# EAGLE design FZ-FILTER (EAGLE 7.7.0)

## Sheet 1 of 2
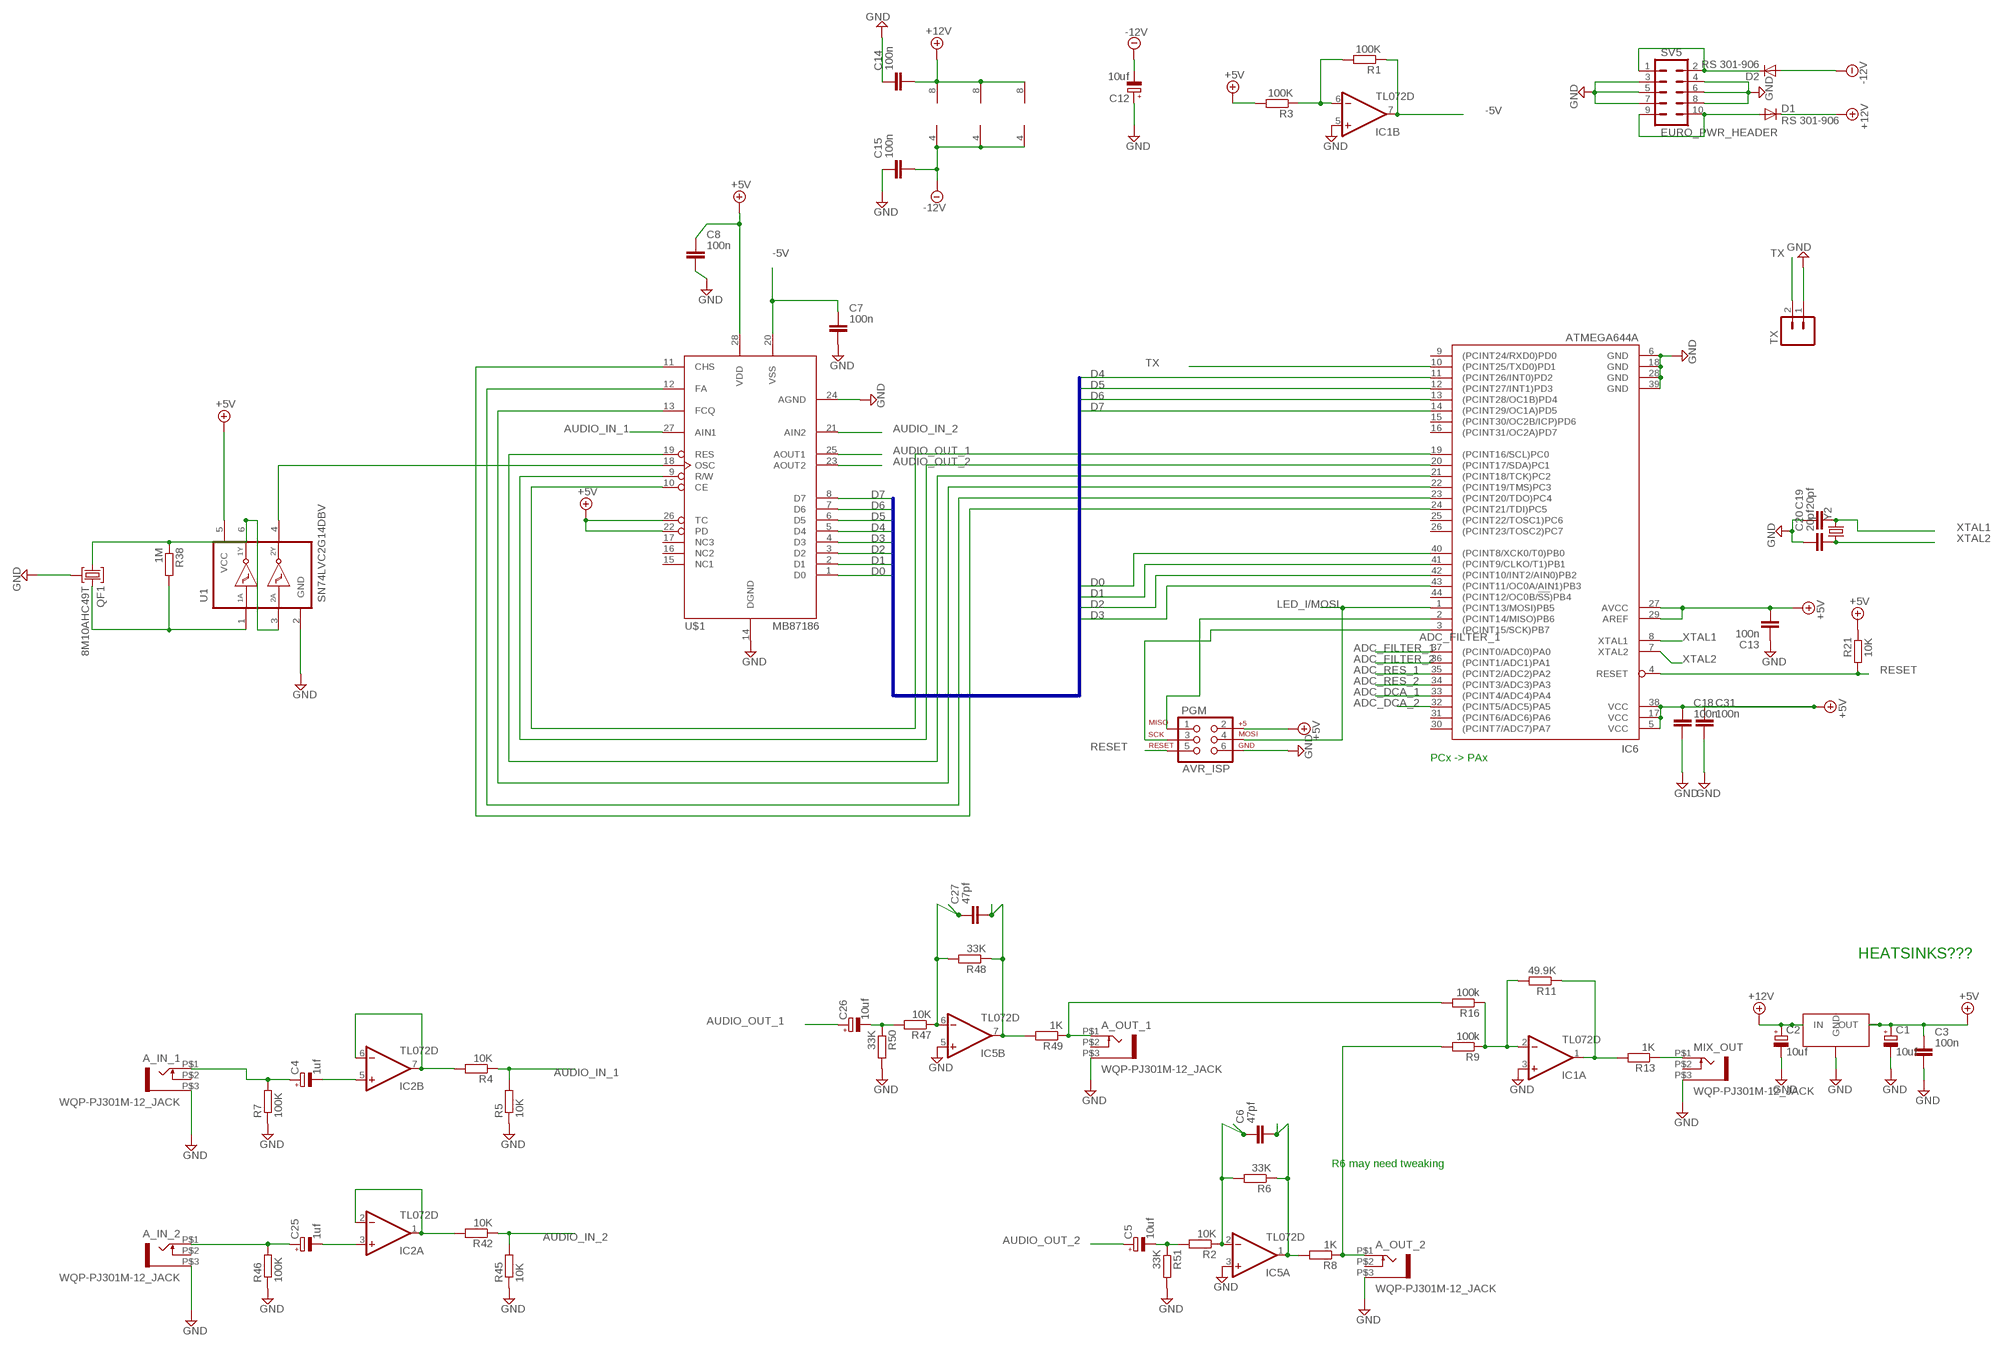
[diagram p0: schematic, sheet 1]

### Parts
A_IN_1  WQP-PJ301M-12_JACK  [WQP-PJ301M-12_JACK]
A_IN_2  WQP-PJ301M-12_JACK  [WQP-PJ301M-12_JACK]
A_OUT_1  WQP-PJ301M-12_JACK  [WQP-PJ301M-12_JACK]
A_OUT_2  WQP-PJ301M-12_JACK  [WQP-PJ301M-12_JACK]
C1  10uf  CPOL-EUB  [PANASONIC_B]
C2  10uf  CPOL-EUB  [PANASONIC_B]
C3  100n  CAPACITOR0603  [C0603]
C4  1uf  CPOL-EUB  [PANASONIC_B]
C5  10uf  CPOL-EUB  [PANASONIC_B]
C6  47pf  CAPACITOR0603  [C0603]
C7  100n  CAPACITOR0603  [C0603]
C8  100n  CAPACITOR0603  [C0603]
C12  10uf  CPOL-EUB  [PANASONIC_B]
C13  100n  CAPACITOR0603  [C0603]
C14  100n  CAPACITOR0603  [C0603]
C15  100n  CAPACITOR0603  [C0603]
C18  100n  CAPACITOR0603  [C0603]
C19  20pf  CAPACITOR0603  [C0603]
C20  20pf  CAPACITOR0603  [C0603]
C25  1uf  CPOL-EUB  [PANASONIC_B]
C26  10uf  CPOL-EUB  [PANASONIC_B]
C27  47pf  CAPACITOR0603  [C0603]
C31  100n  CAPACITOR0603  [C0603]
D1  RS 301-906  DIODESMB  [SMB-DIODE]
D2  RS 301-906  DIODESMB  [SMB-DIODE]
IC1  TL072D  [SO08]
IC2  TL072D  [SO08]
IC5  TL072D  [SO08]
IC6  ATMEGA644A  [TQFP44]
MIX_OUT  WQP-PJ301M-12_JACK  [WQP-PJ301M-12_JACK]
PGM  AVR_ISP  AVR_SPI_PRG_6PTH  [2X3]
QF1  8M10AHC49T  [HC49U]
R1  100K  RESISTOR0603  [R0603]
R2  10K  RESISTOR0603  [R0603]
R3  100K  RESISTOR0603  [R0603]
R4  10K  RESISTOR0603  [R0603]
R5  10K  RESISTOR0603  [R0603]
R6  33K  RESISTOR0603  [R0603]
R7  100K  RESISTOR0603  [R0603]
R8  1K  RESISTOR0603  [R0603]
R9  100k  RESISTOR0603  [R0603]
R11  49.9K  RESISTOR0603  [R0603]
R13  1K  RESISTOR0603  [R0603]
R16  100k  RESISTOR0603  [R0603]
R21  10K  RESISTOR0603  [R0603]
R38  1M  RESISTOR0603  [R0603]
R42  10K  RESISTOR0603  [R0603]
R45  10K  RESISTOR0603  [R0603]
R46  100K  RESISTOR0603  [R0603]
R47  10K  RESISTOR0603  [R0603]
R48  33K  RESISTOR0603  [R0603]
R49  1K  RESISTOR0603  [R0603]
R50  33K  RESISTOR0603  [R0603]
R51  33K  RESISTOR0603  [R0603]
SV5  EURO_PWR_HEADER  [EURO_PWR_HEADER]
TX  M02PTH  [1X02]
U1  SN74LVC2G14DBV  [SOT23-6]
U3  7805  VREG-7805-DPAK2  [VREG-7805-DPAK2]
U$1  MB87186  [DIP28]
Y2  CRYSTALSMD  [HC49UP]

### Nets
+5V: C1.+ C3.1 C8.1 C13.2 C18.1 C31.1 IC6.5(VCC) IC6.17(VCC) IC6.27(AVCC) IC6.29(AREF) IC6.38(VCC) PGM.2 R3.2 R21.2 U1.5(VCC) U3.VOUT(OUT) U$1.22(PD) U$1.26(TC) U$1.28(VDD) ; also sheet 2
+12V: C2.+ C14.2 D1.C IC1.8(P:V+) IC2.8(P:V+) IC5.8(P:V+) U3.VIN(IN) ; also sheet 2
-5V: C7.1 IC1.7(B:OUT) R1.1 U$1.20(VSS) ; also sheet 2
-12V: C12.- C15.2 D2.A IC1.4(P:V-) IC2.4(P:V-) IC5.4(P:V-) ; also sheet 2
ADC_DCA_1: IC6.33((PCINT4/ADC4)PA4) ; also sheet 2
ADC_DCA_2: IC6.32((PCINT5/ADC5)PA5) ; also sheet 2
ADC_FILTER_1: IC6.37((PCINT0/ADC0)PA0) ; also sheet 2
ADC_FILTER_2: IC6.36((PCINT1/ADC1)PA1) ; also sheet 2
ADC_MISO: IC6.2((PCINT14/MISO)PB6) PGM.1
ADC_RES_1: IC6.35((PCINT2/ADC2)PA2) ; also sheet 2
ADC_RES_2: IC6.34((PCINT3/ADC3)PA3) ; also sheet 2
ADC_SCK: IC6.3((PCINT15/SCK)PB7) PGM.3
AUDIO_IN_1: R4.1 R5.2 U$1.27(AIN1)
AUDIO_IN_2: R42.1 R45.2 U$1.21(AIN2)
AUDIO_OUT_1: C26.+ U$1.25(AOUT1)
AUDIO_OUT_2: C5.+ U$1.23(AOUT2)
D0: IC6.40((PCINT8/XCK0/T0)PB0) U$1.1(D0)
D1: IC6.41((PCINT9/CLKO/T1)PB1) U$1.2(D1)
D2: IC6.42((PCINT10/INT2/AIN0)PB2) U$1.3(D2)
D3: IC6.43((PCINT11/OC0A/AIN1)PB3) U$1.4(D3)
D4: IC6.11((PCINT26/INT0)PD2) U$1.5(D4)
D5: IC6.12((PCINT27/INT1)PD3) U$1.6(D5)
D6: IC6.13((PCINT28/OC1B)PD4) U$1.7(D6)
D7: IC6.14((PCINT29/OC1A)PD5) U$1.8(D7)
GND: A_IN_1.P$3 A_IN_2.P$3 A_OUT_1.P$3 A_OUT_2.P$3 C1.- C2.- C3.2 C7.2 C8.2 C12.+ C13.1 C14.1 C15.1 C18.2 C19.1 C20.1 C31.2 IC1.3(A:+IN) IC1.5(B:+IN) IC5.3(A:+IN) IC5.5(B:+IN) IC6.6(GND) IC6.18(GND) IC6.28(GND) IC6.39(GND) MIX_OUT.P$3 PGM.6 QF1.2 R5.1 R7.1 R45.1 R46.1 R50.2 R51.2 SV5.3 SV5.4 SV5.5 SV5.6 SV5.7 SV5.8 TX.1 U1.2(GND) U3.GND U$1.14(DGND) U$1.24(AGND) ; also sheet 2
LED_I/MOSI: IC6.1((PCINT13/MOSI)PB5) PGM.4
N$1: D2.C SV5.1 SV5.2
N$2: IC1.6(B:-IN) R1.2 R3.1
N$3: D1.A SV5.9 SV5.10
N$4: IC2.6(B:-IN) IC2.7(B:OUT) R4.2
N$6: C6.1 IC5.2(A:-IN) R2.1 R6.2
N$7: C6.2 IC5.1(A:OUT) R6.1 R8.2
N$8: C5.- R2.2 R51.1
N$9: A_OUT_1.P$1 R16.2 R49.1
N$13: IC1.2(A:-IN) R9.1 R11.2 R16.1
N$14: IC1.1(A:OUT) R11.1 R13.2
N$16: A_OUT_2.P$1 R8.1 R9.2
N$17: C4.- IC2.5(B:+IN)
N$18: A_IN_1.P$1 C4.+ R7.2
N$19: C25.- IC2.3(A:+IN)
N$28: IC2.1(A:OUT) IC2.2(A:-IN) R42.2
N$29: A_IN_2.P$1 C25.+ R46.2
N$30: C27.1 IC5.6(B:-IN) R47.1 R48.2
N$31: C27.2 IC5.7(B:OUT) R48.1 R49.2
N$32: C26.- R47.2 R50.1
N$34: MIX_OUT.P$1 R13.1
N$37: IC6.19((PCINT16/SCL)PC0) U$1.10(CE)
N$38: IC6.20((PCINT17/SDA)PC1) U$1.9(R/W)
N$39: IC6.21((PCINT18/TCK)PC2) U$1.19(RES)
N$42: IC6.22((PCINT19/TMS)PC3) U$1.13(FCQ)
N$47: IC6.23((PCINT20/TDO)PC4) U$1.12(FA)
N$54: IC6.24((PCINT21/TDI)PC5) U$1.11(CHS)
N$56: U1.4(2Y) U$1.18(OSC)
N$60: QF1.1 R38.1 U1.3(2A) U1.6(1Y)
N$62: QF1.3 R38.2 U1.1(1A)
RESET: IC6.4(RESET) PGM.5 R21.1
TX: IC6.10((PCINT25/TXD0)PD1) TX.2
XTAL1: C19.2 IC6.8(XTAL1) Y2.2
XTAL2: C20.2 IC6.7(XTAL2) Y2.1
Unconnected: A_IN_1.P$2 A_IN_2.P$2 A_OUT_1.P$2 A_OUT_2.P$2 IC6.9((PCINT24/RXD0)PD0) IC6.15((PCINT30/OC2B/ICP)PD6) IC6.16((PCINT31/OC2A)PD7) IC6.25((PCINT22/TOSC1)PC6) IC6.26((PCINT23/TOSC2)PC7) IC6.30((PCINT7/ADC7)PA7) IC6.31((PCINT6/ADC6)PA6) IC6.44((PCINT12/OC0B/!SS!)PB4) MIX_OUT.P$2 U$1.15(NC1) U$1.16(NC2) U$1.17(NC3)

### Buses
D[0..7]

### Notes on the sheet
- PCx -> PAx
- HEATSINKS???
- R6 may need tweaking

## Sheet 2 of 2
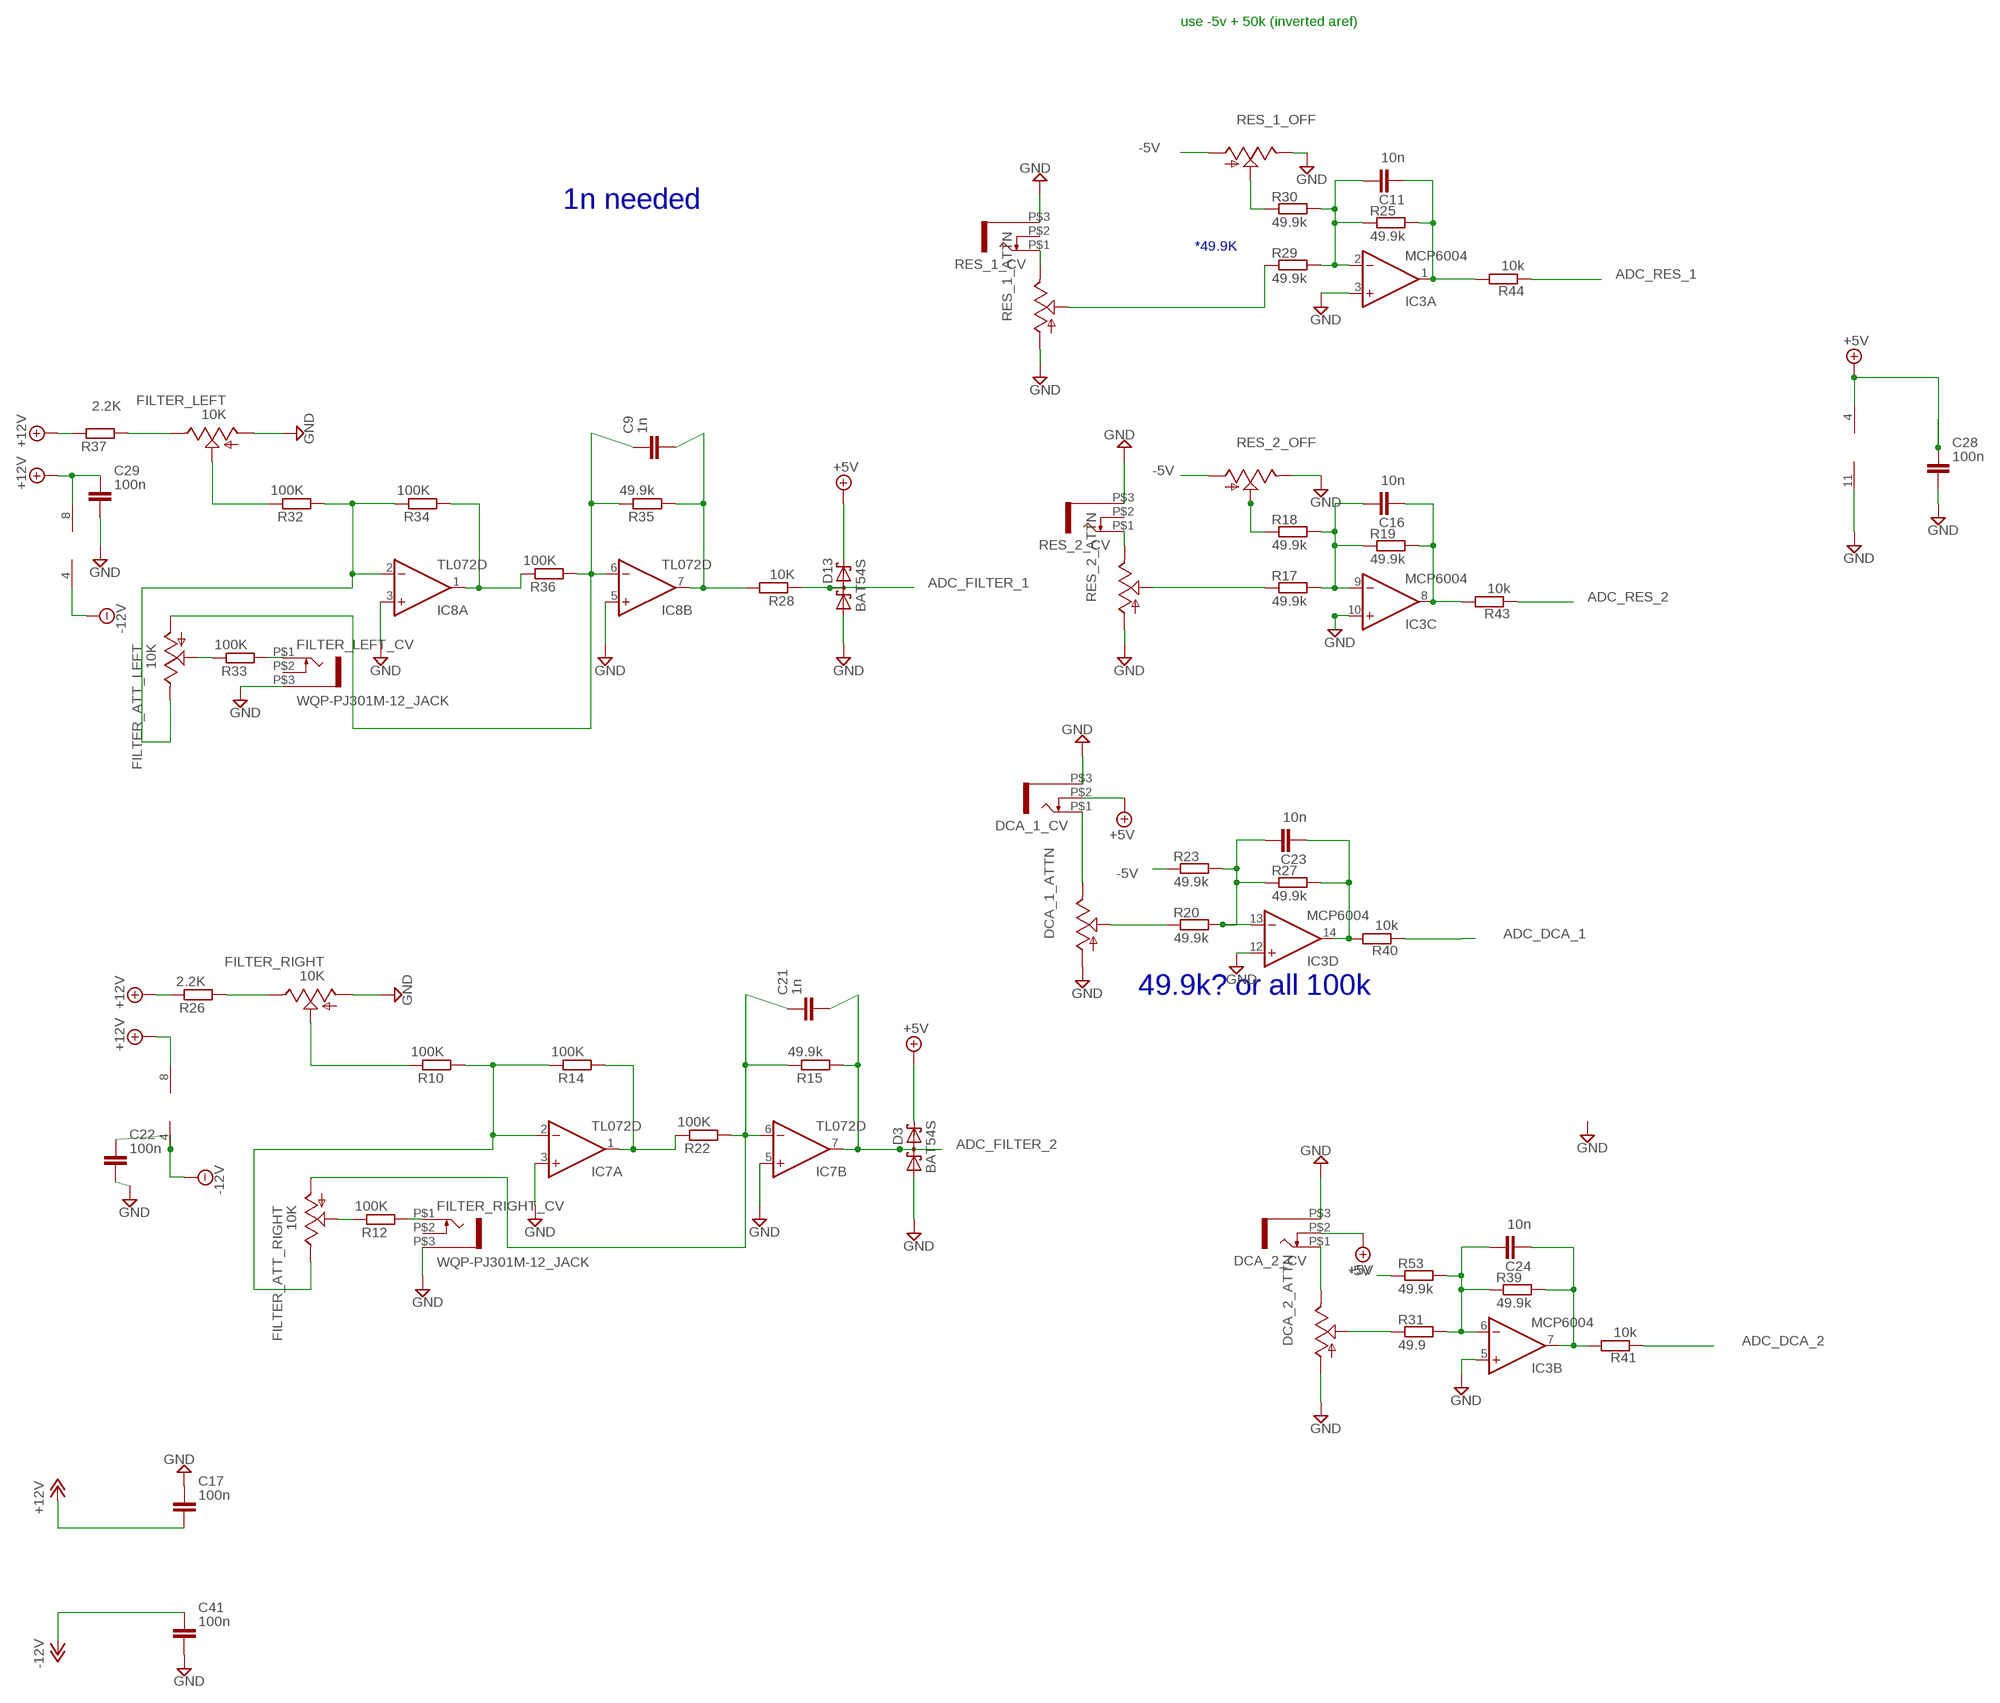
[diagram p1: schematic, sheet 2]

### Parts
C9  1n  CAPACITOR0603  [C0603]
C11  10n  CAPACITOR0603  [C0603]
C16  10n  CAPACITOR0603  [C0603]
C17  100n  CAPACITOR0603  [C0603]
C21  1n  CAPACITOR0603  [C0603]
C22  100n  CAPACITOR0603  [C0603]
C23  10n  CAPACITOR0603  [C0603]
C24  10n  CAPACITOR0603  [C0603]
C28  100n  CAPACITOR0603  [C0603]
C29  100n  CAPACITOR0603  [C0603]
C41  100n  CAPACITOR0603  [C0603]
D3  BAT54S  [SOT23]
D13  BAT54S  [SOT23]
DCA_1_ATTN  ALPHA-9MMA  [EVUF]
DCA_1_CV  WQP-PJ301M-12_JACK  [WQP-PJ301M-12_JACK]
DCA_2_ATTN  ALPHA-9MMA  [EVUF]
DCA_2_CV  WQP-PJ301M-12_JACK  [WQP-PJ301M-12_JACK]
FILTER_ATT_LEFT  10K  ALPHA-9MMA  [EVUF]
FILTER_ATT_RIGHT  10K  ALPHA-9MMA  [EVUF]
FILTER_LEFT  10K  ALPHA-9MMA  [EVUF]
FILTER_LEFT_CV  WQP-PJ301M-12_JACK  [WQP-PJ301M-12_JACK]
FILTER_RIGHT  10K  ALPHA-9MMA  [EVUF]
FILTER_RIGHT_CV  WQP-PJ301M-12_JACK  [WQP-PJ301M-12_JACK]
IC3  MCP6004  TL074D  [SO14]
IC7  TL072D  [SO08]
IC8  TL072D  [SO08]
R10  100K  RESISTOR0603  [R0603]
R12  100K  RESISTOR0603  [R0603]
R14  100K  RESISTOR0603  [R0603]
R15  49.9k  RESISTOR0603  [R0603]
R17  49.9k  RESISTOR0603  [R0603]
R18  49.9k  RESISTOR0603  [R0603]
R19  49.9k  RESISTOR0603  [R0603]
R20  49.9k  RESISTOR0603  [R0603]
R22  100K  RESISTOR0603  [R0603]
R23  49.9k  RESISTOR0603  [R0603]
R25  49.9k  RESISTOR0603  [R0603]
R26  2.2K  RESISTOR0603  [R0603]
R27  49.9k  RESISTOR0603  [R0603]
R28  10K  RESISTOR0603  [R0603]
R29  49.9k  RESISTOR0603  [R0603]
R30  49.9k  RESISTOR0603  [R0603]
R31  49.9  RESISTOR0603  [R0603]
R32  100K  RESISTOR0603  [R0603]
R33  100K  RESISTOR0603  [R0603]
R34  100K  RESISTOR0603  [R0603]
R35  49.9k  RESISTOR0603  [R0603]
R36  100K  RESISTOR0603  [R0603]
R37  2.2K  RESISTOR0603  [R0603]
R39  49.9k  RESISTOR0603  [R0603]
R40  10k  RESISTOR0603  [R0603]
R41  10k  RESISTOR0603  [R0603]
R43  10k  RESISTOR0603  [R0603]
R44  10k  RESISTOR0603  [R0603]
R53  49.9k  RESISTOR0603  [R0603]
RES_1_ATTN  ALPHA-9MMA  [EVUF]
RES_1_CV  WQP-PJ301M-12_JACK  [WQP-PJ301M-12_JACK]
RES_1_OFF  ALPHA-9MMA  [EVUF]
RES_2_ATTN  ALPHA-9MMA  [EVUF]
RES_2_CV  WQP-PJ301M-12_JACK  [WQP-PJ301M-12_JACK]
RES_2_OFF  ALPHA-9MMA  [EVUF]

### Nets
+5V: C28.1 D3.2(C2) D13.2(C2) DCA_1_CV.P$2 DCA_2_CV.P$2 IC3.4(P:V+) ; also sheet 1
+12V: C17.2 C29.1 IC7.8(P:V+) IC8.8(P:V+) R26.2 R37.2 ; also sheet 1
-5V: R23.1 R53.1 RES_1_OFF.1(A) RES_2_OFF.1(A) ; also sheet 1
-12V: C22.1 C41.1 IC7.4(P:V-) IC8.4(P:V-) ; also sheet 1
ADC_DCA_1: R40.1 ; also sheet 1
ADC_DCA_2: R41.1 ; also sheet 1
ADC_FILTER_1: D13.3(C1A2) R28.1 ; also sheet 1
ADC_FILTER_2: C21.2 D3.3(C1A2) IC7.7(B:OUT) R15.1 ; also sheet 1
ADC_RES_1: R44.1 ; also sheet 1
ADC_RES_2: R43.1 ; also sheet 1
GND: C17.1 C22.2 C28.2 C29.2 C41.2 D3.1(A1) D13.1(A1) DCA_1_ATTN.1(A) DCA_1_CV.P$3 DCA_2_ATTN.1(A) DCA_2_CV.P$3 FILTER_LEFT.1(A) FILTER_LEFT_CV.P$3 FILTER_RIGHT.1(A) FILTER_RIGHT_CV.P$3 IC3.3(A:+IN) IC3.5(B:+IN) IC3.10(C:+IN) IC3.11(P:V-) IC3.12(D:+IN) IC7.3(A:+IN) IC7.5(B:+IN) IC8.3(A:+IN) IC8.5(B:+IN) RES_1_ATTN.1(A) RES_1_CV.P$3 RES_1_OFF.3(E) RES_2_ATTN.1(A) RES_2_CV.P$3 RES_2_OFF.3(E) ; also sheet 1
I7: C9.2 IC8.7(B:OUT) R28.2 R35.1
N$5: RES_1_ATTN.3(E) RES_1_CV.P$1
N$10: R30.1 RES_1_OFF.2(S)
N$11: C24.1 IC3.6(B:-IN) R31.2 R39.1 R53.2
N$12: C11.2 IC3.1(A:OUT) R25.2 R44.2
N$15: R29.1 RES_1_ATTN.2(S)
N$20: DCA_1_ATTN.3(E) DCA_1_CV.P$1
N$21: C16.1 IC3.9(C:-IN) R17.2 R18.2 R19.1
N$22: R18.1 RES_2_OFF.2(S)
N$23: RES_2_ATTN.3(E) RES_2_CV.P$1
N$24: C23.1 IC3.13(D:-IN) R20.2 R23.2 R27.1
N$25: DCA_1_ATTN.2(S) R20.1
N$26: DCA_2_ATTN.2(S) R31.1
N$27: C16.2 IC3.8(C:OUT) R19.2 R43.2
N$33: DCA_2_ATTN.3(E) DCA_2_CV.P$1
N$35: FILTER_RIGHT.2(S) R10.2
N$36: FILTER_ATT_RIGHT.3(E) IC7.2(A:-IN) R10.1 R14.2
N$40: C11.1 IC3.2(A:-IN) R25.1 R29.2 R30.2
N$41: FILTER_RIGHT_CV.P$1 R12.1
N$43: FILTER_ATT_RIGHT.2(S) R12.2
N$44: IC7.1(A:OUT) R14.1 R22.2
N$45: C21.1 FILTER_ATT_RIGHT.1(A) IC7.6(B:-IN) R15.2 R22.1
N$46: FILTER_RIGHT.3(E) R26.1
N$48: FILTER_LEFT.2(S) R32.2
N$49: FILTER_ATT_LEFT.3(E) IC8.2(A:-IN) R32.1 R34.2
N$50: FILTER_LEFT_CV.P$1 R33.1
N$51: IC8.1(A:OUT) R34.1 R36.2
N$52: C9.1 FILTER_ATT_LEFT.1(A) IC8.6(B:-IN) R35.2 R36.1
N$53: FILTER_LEFT.3(E) R37.1
N$55: FILTER_ATT_LEFT.2(S) R33.2
N$58: R17.1 RES_2_ATTN.2(S)
REL1_ADC: C23.2 IC3.14(D:OUT) R27.2 R40.2
REL2_ADC: C24.2 IC3.7(B:OUT) R39.2 R41.2
Unconnected: FILTER_LEFT_CV.P$2 FILTER_RIGHT_CV.P$2 RES_1_CV.P$2 RES_2_CV.P$2

### Notes on the sheet
- use -5v + 50k (inverted aref)
- 1n needed
- *49.9K
- 49.9k? or all 100k

## Library data of the parts
A_IN_1 A_IN_2 A_OUT_1 A_OUT_2 DCA_1_CV DCA_2_CV FILTER_LEFT_CV FILTER_RIGHT_CV MIX_OUT RES_1_CV RES_2_CV = allum_extras:WQP-PJ301M-12_JACK
C1 C2 C4 C5 C12 C25 C26 = rcl:CPOL-EU: POLARIZED CAPACITOR, European symbol
C3 C6-C9 C13-C15 C17-C22 C27-C29 C31 C41 = allum_extras:CAPACITOR
C11 C16 C23 C24 = local:CAPACITOR
D1 D2 = SparkFun:DIODE: Diode These are standard reverse protection diodes and small signal diodes. SMA package can handle up to about 1A. SOD-323 can handle about 200mA. What the SOD-323 package when ordering, there are some mfgs out there that are 5-pin packages.
D3 D13 = diode:BAT54S: Schottky Diodes Pin connection corrected 2011-05-04 Source: Fairchild .. BAT54.pdf
DCA_1_ATTN DCA_2_ATTN FILTER_ATT_LEFT FILTER_ATT_RIGHT FILTER_LEFT FILTER_RIGHT RES_1_ATTN RES_1_OFF RES_2_ATTN RES_2_OFF = TomW:ALPHA-9MM: 9 mm Square Rotary Potentiometers Source: Panasonic
IC1 IC2 IC5 IC7 IC8 = TomW:TL072: OP AMP
IC3 = gm-ics:TL074: OP AMP
IC6 = atmel:ATMEGA644: 8-bit Microcontroller with 64K Bytes In-System Programmable Flash Source: http://www.atmel.com/dyn/resources/prod_documents/doc2593.pdf; MPN: ATMEGA644PV-10AU; OC_FARNELL: 1455123; OC_NEWARK: 58M3748
PGM = SparkFun:AVR_SPI_PRG_6: AVR ISP 6 Pin This is the reduced ISP connector for AVR programming. Common on Arduino. This footprint will take up less PCB space and can be used with a 10-pin to 6-pin adapter such as SKU: BOB-08508
QF1 = crystal:8M10AHC49T: Monolithic Crystal Filters Source: www.vanlong.com; OC_FARNELL: unknown; OC_NEWARK: unknown
R1-R23 R25-R51 R53 = allum_extras:RESISTOR
SV5 = local:EURO_PWR_HEADER: Header 5x2 Standard 10-pin dual row 0.1" header. Commonly used with AVR-ISP. Use with Spark Fun Electronics SKU: PRT-00778
TX = SparkFun:M02: Header 2 Standard 2-pin 0.1" header. Use with straight break away headers (SKU : PRT-00116), right angle break away headers (PRT-00553), swiss pins (PRT-00743), machine pins (PRT-00117), and female headers (PRT-00115). Molex polarized connector foot print use with SKU : PRT-08233 with associated crimp pins and housings.
U1 = 74LV:SN74LVC2G14: DUAL SCHMITT-TRIGGER INVERTER
U3 = vreg-7805-dpak2:VREG-7805-DPAK2
U$1 = allum_extras:MB87186
Y2 = SparkFun:CRYSTAL: Crystals Various standard crystals. Proven footprints. Spark Fun Electronics SKU : COM-00534

## Board
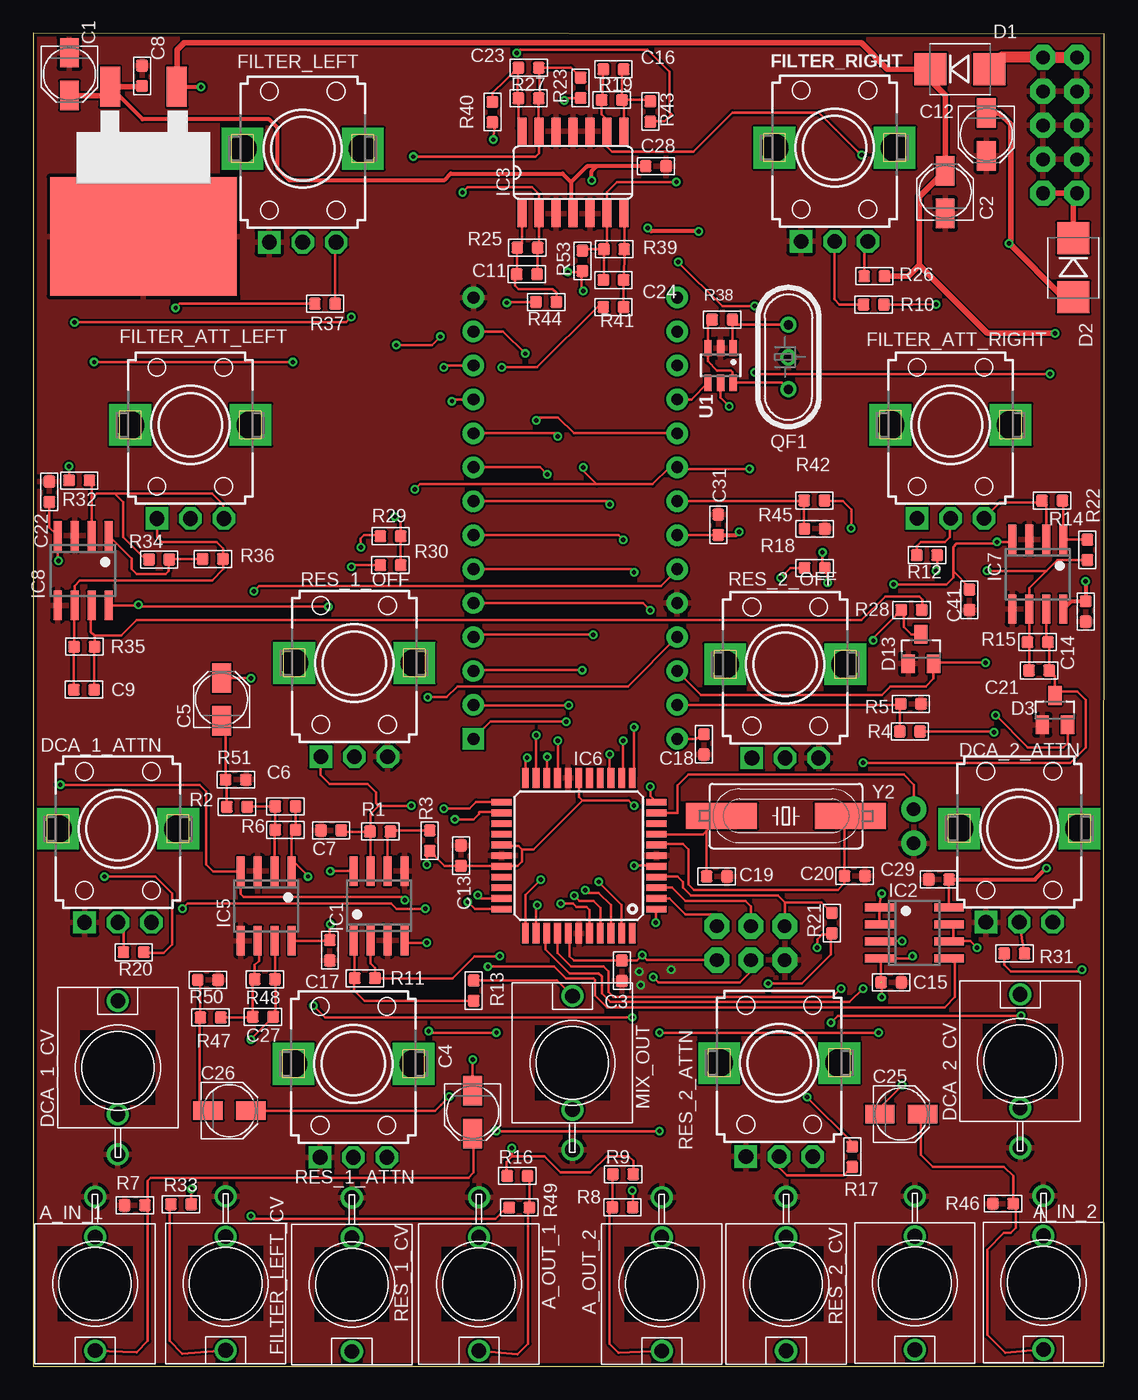
[diagram p2: board, top side]
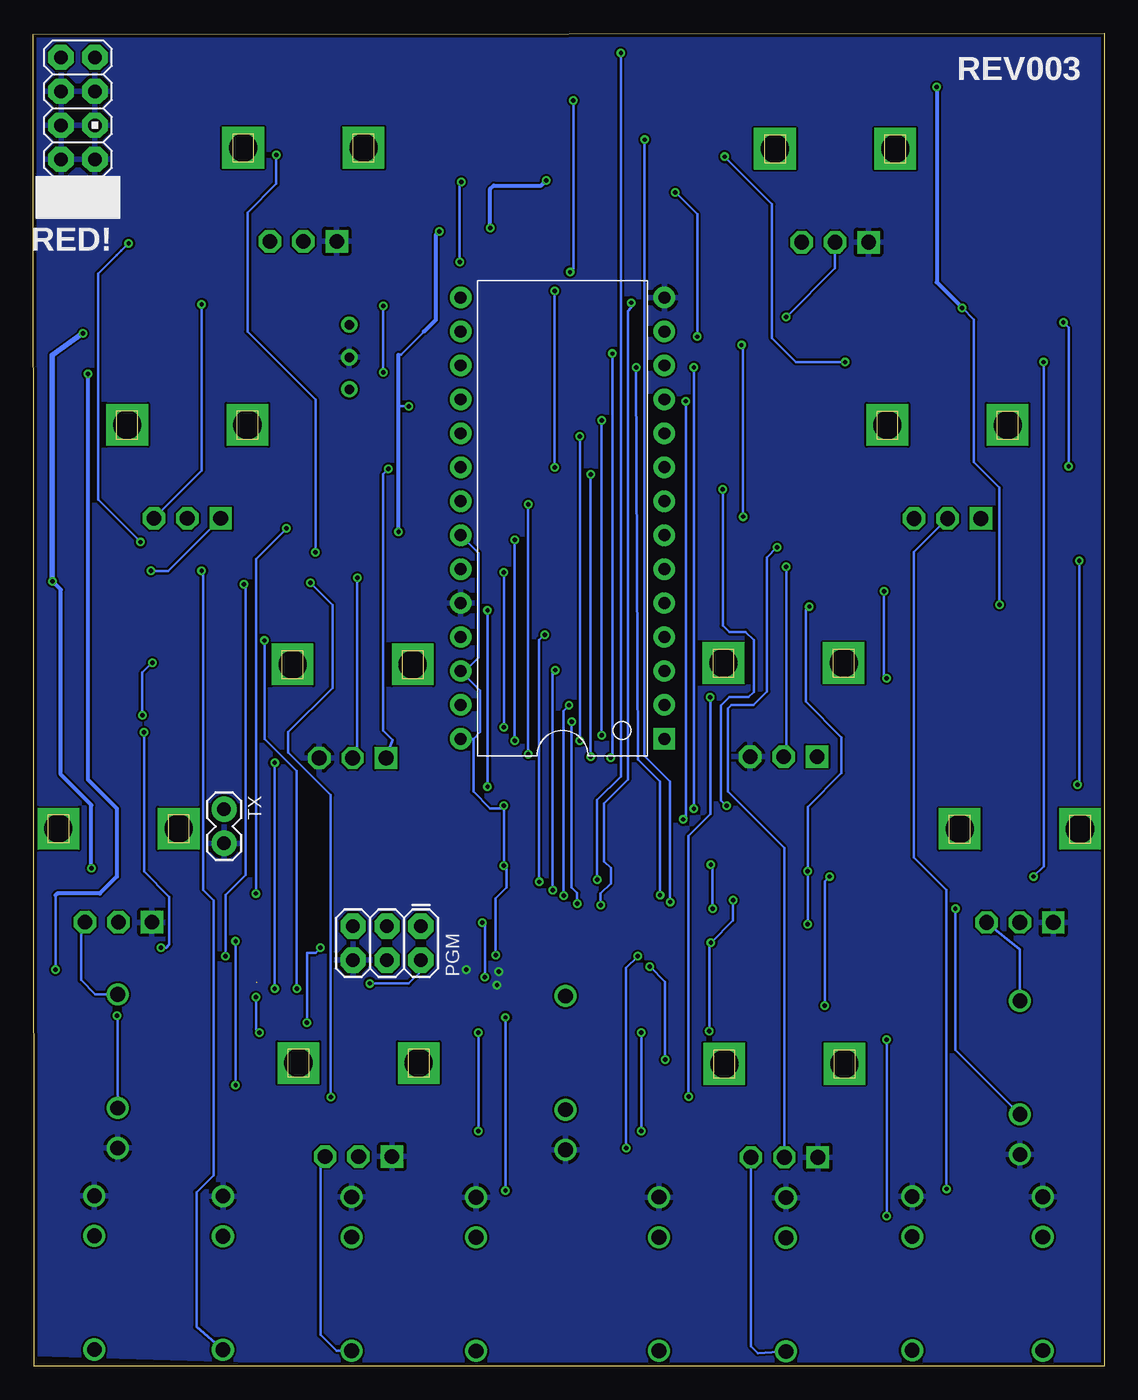
[diagram p3: board, bottom side, seen from below]

Size 80.13 x 99.7 mm. Coordinates in mm from the lower left corner, seen from the top.
Outline: 0,0 80.08,0 80.13,99.64 0,99.69 0,0
Copper layers (1*16): Top 0.035mm / dielectric 1.5mm / Bottom 0.035mm
Design rules "Fusion_eagle_rule_v1.1": minimum track width 6mil, minimum drill 12mil, track to track 6mil, track to pad 6mil, pad to pad 6mil, via to via 6mil, smd to smd 0mil, copper to edge 10mil, drill to drill 10mil, minimum pad ring 10mil, minimum via ring 6mil, stop-mask expansion 2mil, vias tented up to drill 100mil, thermal gap 10mil

### Footprints (pad centres in the part's own frame; a part is rotated, then mirrored left to right if it is on the bottom)
WQP-PJ301M-12_JACK = drill 1.1: P$1 0,5; P$2 0,-3.5; P$3 0,-6.5
PANASONIC_B = smd 2.2 x 1.4: + 1.6,0; - -1.6,0
C0603 = smd 0.889 x 0.889: 1 -0.762,0; 2 0.762,0
SMB-DIODE = smd 2.4 x 2.4: A 2.2,0; C -2.2,0
SOT23 = smd 1 x 1.4: 1 -0.95,-1.1; 2 0.95,-1.1; 3 0,1.1
EVUF = drill 1.1 pad 1.676 square: 1 -2.5,-7 | drill 1.1 pad 1.676 octagon: 2 0,-7; 3 2.5,-7 | drill 2.1 pad 2.8 square: M1 4.5,0; M2 -4.5,0
SO08 = smd 0.6 x 2.2: 1 -1.905,-2.6; 2 -0.635,-2.6; 3 0.635,-2.6; 4 1.905,-2.6; 5 1.905,2.6; 6 0.635,2.6; 7 -0.635,2.6; 8 -1.905,2.6
SO14 = smd 0.66 x 2.032: 1 -3.81,-3.073; 2 -2.54,-3.073; 3 -1.27,-3.073; 4 0,-3.073; 5 1.27,-3.073; 6 2.54,-3.073; 7 3.81,-3.073; 8 3.81,3.073; 9 2.54,3.073; 10 1.27,3.073; 11 0,3.073; 12 -1.27,3.073; 13 -2.54,3.073; 14 -3.81,3.073
TQFP44 = smd 1.5 x 0.5: 1 -5.8,4; 2 -5.8,3.2; 3 -5.8,2.4; 4 -5.8,1.6; 5 -5.8,0.8; 6 -5.8,0; 7 -5.8,-0.8; 8 -5.8,-1.6; 9 -5.8,-2.4; 10 -5.8,-3.2; 11 -5.8,-4; 23 5.8,-4; 24 5.8,-3.2; 25 5.8,-2.4; 26 5.8,-1.6; 27 5.8,-0.8; 28 5.8,0; 29 5.8,0.8; 30 5.8,1.6; 31 5.8,2.4; 32 5.8,3.2; 33 5.8,4 | smd 0.5 x 1.5: 12 -4,-5.8; 13 -3.2,-5.8; 14 -2.4,-5.8; 15 -1.6,-5.8; 16 -0.8,-5.8; 17 0,-5.8; 18 0.8,-5.8; 19 1.6,-5.8; 20 2.4,-5.8; 21 3.2,-5.8; 22 4,-5.8; 34 4,5.8; 35 3.2,5.8; 36 2.4,5.8; 37 1.6,5.8; 38 0.8,5.8; 39 0,5.8; 40 -0.8,5.8; 41 -1.6,5.8; 42 -2.4,5.8; 43 -3.2,5.8; 44 -4,5.8
2X3 = drill 1.016 pad 1.88 octagon: 1 0,0; 2 0,2.54; 3 2.54,0; 4 2.54,2.54; 5 5.08,0; 6 5.08,2.54
HC49U = drill 0.7 pad 1.2: 1 -2.413,0; 2 -0.027,0; 3 2.413,0
R0603 = smd 0.889 x 0.889: 1 -0.762,0; 2 0.762,0
EURO_PWR_HEADER = drill 1.016 pad 1.88 octagon: 1 -1.27,5.08; 2 1.27,5.08; 3 -1.27,2.54; 4 1.27,2.54; 5 -1.27,0; 6 1.27,0; 7 -1.27,-2.54; 8 1.27,-2.54; 9 -1.27,-5.08; 10 1.27,-5.08
1X02 = drill 1.016 pad 1.88: 1 0,0; 2 2.54,0
SOT23-6 = smd 0.55 x 1.2: 1 -0.95,-1.3; 2 0,-1.3; 3 0.95,-1.3; 4 0.95,1.3; 5 0,1.3; 6 -0.95,1.3
VREG-7805-DPAK2 = smd 13.97 x 8.89: GND 0,8.7 | smd 1.5 x 3: VIN -2.5,-2.5; VOUT 2.5,-2.5
DIP28 = drill 0.889 pad 1.6 square: 1 -15.24,-7.62 | drill 0.889 pad 1.6: 2 -12.7,-7.62; 3 -10.16,-7.62; 4 -7.62,-7.62; 5 -5.08,-7.62; 6 -2.54,-7.62; 7 0,-7.62; 8 2.54,-7.62; 9 5.08,-7.62; 10 7.62,-7.62; 11 10.16,-7.62; 12 12.7,-7.62; 13 15.24,-7.62; 14 17.78,-7.62; 15 17.78,7.62; 16 15.24,7.62; 17 12.7,7.62; 18 10.16,7.62; 19 7.62,7.62; 20 5.08,7.62; 21 2.54,7.62; 22 0,7.62; 23 -2.54,7.62; 24 -5.08,7.62; 25 -7.62,7.62; 26 -10.16,7.62; 27 -12.7,7.62; 28 -15.24,7.62
HC49UP = smd 5.334 x 1.93: 1 -4.826,0; 2 4.826,0

### Placement (x,y rotation side)
A_IN_1  4.62,6.16 180 top
A_IN_2  75.57,6.24 180 top
A_OUT_1  33.33,6.14 180 top
A_OUT_2  47.01,6.13 180 top
C1  2.7,96.65 270 top
C2  68.21,87.82 90 top
C3  44.02,29.57 270 top
C4  32.86,19 270 top
C5  14.08,49.88 90 top
C6  18.85,41.87 0 top
C7  22.27,40.08 180 top
C8  8.13,96.52 90 top
C9  3.78,50.6 0 top
C11  36.92,81.68 180 top
C12  71.29,92.14 270 top
C13  31.99,38.19 270 top
C14  78.72,56.45 90 top
C15  64.17,28.7 180 top
C16  43.4,97 0 top
C17  22.18,31.1 90 top
C18  50.16,46.51 270 top
C19  51.13,36.63 180 top
C20  61.45,36.67 180 top
C21  75.23,52.04 0 top
C22  1.19,65.41 90 top
C23  37.05,97.13 180 top
C24  43.4,81.26 0 top
C25  64.93,18.85 0 top
C26  14.66,19.11 0 top
C27  17.18,26.13 0 top
C28  46.57,89.76 0 top
C29  67.74,36.4 180 top
C31  51.23,62.94 90 top
C41  70.03,57.33 270 top
D1  69.32,97.03 0 top
D2  77.8,82.17 270 top
D3  76.43,49.07 0 top
D13  66.4,53.64 0 top
DCA_1_ATTN  6.33,40.19 0 top
DCA_1_CV  6.32,22.33 0 top
DCA_2_ATTN  73.76,40.21 0 top
DCA_2_CV  73.82,22.81 0 top
FILTER_ATT_LEFT  11.74,70.41 0 top
FILTER_ATT_RIGHT  68.62,70.41 0 top
FILTER_LEFT  20.15,91.07 0 top
FILTER_LEFT_CV  14.38,6.18 180 top
FILTER_RIGHT  59.93,91.15 0 top
FILTER_RIGHT_CV  65.95,6.22 180 top
IC1  25.86,34.44 0 top
IC2  65.89,32.4 270 top
IC3  40.36,89.29 0 top
IC5  17.42,34.43 180 top
IC6  40.81,38.18 180 top
IC7  75.14,59.23 180 top
IC8  3.71,59.51 180 top
MIX_OUT  40.32,22.68 0 top
PGM  51.14,32.91 180 bottom
QF1  56.49,75.49 90 top
R1  25.95,39.99 0 top
R2  15.23,41.83 180 top
R3  29.65,39.31 270 top
R4  65.57,47.47 0 top
R5  65.64,49.55 180 top
R6  18.85,40.12 180 top
R7  7.58,12.03 0 top
R8  44.08,11.88 0 top
R9  44.11,14.35 180 top
R10  62.87,79.42 180 top
R11  24.8,29.02 0 top
R12  66.85,60.66 180 top
R13  32.94,28.09 270 top
R14  76.22,64.75 180 top
R15  75.13,54.15 180 top
R16  36.2,14.23 0 top
R17  61.26,15.66 90 top
R18  58.45,59.72 0 top
R19  43.27,94.72 0 top
R20  7.5,30.96 0 top
R21  59.74,33.14 270 top
R22  78.86,61.06 90 top
R23  40.94,95.63 90 top
R25  36.96,83.67 180 top
R26  62.91,81.52 0 top
R27  37.04,94.84 180 top
R28  65.69,56.57 0 top
R29  26.72,62.08 0 top
R30  26.72,59.92 0 top
R31  73.39,30.86 180 top
R32  3.43,66.26 180 top
R33  11.05,12.11 0 top
R34  9.41,60.34 180 top
R35  3.81,53.81 180 top
R36  13.42,60.38 180 top
R37  21.82,79.48 180 top
R38  51.54,78.28 0 top
R39  43.44,83.54 0 top
R40  34.34,93.81 90 top
R41  43.4,79.22 0 top
R42  58.42,64.76 0 top
R43  46.15,93.85 90 top
R44  38.36,79.6 0 top
R45  58.44,62.64 180 top
R46  72.54,12.16 0 top
R47  13.26,26.08 180 top
R48  17.32,28.94 180 top
R49  36.35,11.86 180 top
R50  13.05,28.89 0 top
R51  15.14,43.87 0 top
R53  41.07,82.68 90 top
RES_1_ATTN  23.94,22.61 0 top
RES_1_CV  23.82,6.1 180 top
RES_1_OFF  24,52.59 0 top
RES_2_ATTN  55.8,22.68 0 top
RES_2_CV  56.31,6.15 180 top
RES_2_OFF  56.25,52.49 0 top
SV5  76.79,92.82 180 bottom
TX  65.86,39.12 90 bottom
U1  51.41,74.85 180 top
U3  8.23,93.21 180 top
U$1  40.54,62.16 90 bottom
U$2  [LOGO_WEEE]  12.55,0.81 0 bottom
Y2  56.3,41.15 180 top

### Tracks (layer width: path | path; a pad name or v marks a point on that pad's centre or on a via)
+5V  (via drill 0.33)
  Top 0.203: v44.93,37.44 46.55,37.44 IC6.5 | IC6.17 40.81,42.58 41.07,42.32 | 41.07,42.32 44.53,42.32 v44.93,41.91 | 51.14,30.39 PGM.2 45.91,30.37 v45.54,30.73 45.14,30.33 C3.1 40.43,30.33 40.11,30.66 40.11,32.28 IC6.38 | U$1.22 51.21,62.16 C31.1 | v73.89,26.21 60.17,26.21 v59.66,25.7 | 59.79,32.33 R21.2 | 34.96,37.43 C13.2 30.77,37.43 R3.2 29.44,38.33 v29.44,37.52 | 34.96,37.43 IC6.29 | 34.96,37.43 36.21,37.43 36.55,37.77 36.55,38.66 | 36.55,38.66 36.3,38.91 35.08,38.91 IC6.27 | 36.55,38.66 37.41,38.66 41.07,42.32 | v29.31,34.21 27.15,34.21 26.77,34.59 11.53,34.59 v11.15,34.21 | U$1.28 49.56,46.92 C18.1 | v54.97,28.63 57.51,28.63 59.66,30.78 59.66,32.31 R21.2 | v58.65,31.29 58.65,31.93 59.03,32.31 59.67,32.31 R21.2 | U1.5 51.41,72.44 v52.04,71.81 | D3.2 77.38,46.59 77.06,46.28 74.4,46.28 v71.98,48.69 | v71.22,52.63 67.43,52.63 D13.2 67.35,51.42 66.78,50.85 64.11,50.85 63.47,50.22 49.95,50.22 U$1.26
  Top 0.305: 40.23,88.57 39.6,89.2 31.22,89.2 30.71,88.7 19.15,88.7 18.26,89.59 18.26,92.63 17.63,93.27 8.17,93.27 U3.VOUT | 40.23,88.57 40.23,86.35 IC3.4 | C28.1 42.14,89.76 | 42.14,89.76 41.42,89.76 40.23,88.57 | v49.76,84.89 46.2,84.89 v45.95,85.14 | v41.76,88.7 41.76,89.38 42.14,89.76 | 51.21,62.16 52.56,62.16 v52.81,62.41
  Top 0.406: C8.1 8.08,95.71 U3.VOUT 5.07,95.05 C1.+
  Bottom 0.203: v45.54,30.73 45.54,35 44.73,35.81 44.73,37.24 v44.93,37.44 v44.93,41.91 45.14,41.71 45.95,41.71 47.21,42.97 47.21,46.92 | DCA_2_CV.P$2 73.82,26.15 v73.89,26.21 | v59.66,25.7 59.66,30.91 59.03,30.91 v58.65,31.29 | U$1.28 47.21,46.92 | 47.21,46.92 46.71,47.42 46.71,50.55 U$1.26 47.85,52 46.84,53.01 46.84,60.83 U$1.22 | v11.15,34.21 11.15,23.66 DCA_1_CV.P$2 | v29.31,34.21 29.31,37.39 v29.44,37.52 | PGM.2 51.14,29.53 52.04,28.63 v54.97,28.63 | 52.81,75.66 52.64,75.66 50.91,77.39 | v52.04,71.81 52.81,71.81 | v71.98,48.69 71.98,51.87 v71.22,52.63
  Bottom 0.305: 50.91,77.39 50.01,78.28 50.01,84.63 v49.76,84.89 | v45.95,85.14 45.95,88.06 45.69,88.32 42.14,88.32 v41.76,88.7 | v52.81,62.41 52.81,71.81 52.81,75.66
+12V  (via drill 0.33)
  Top 0.203: IC8.8 7.81,56.91 v7.85,56.95 7.98,56.82 v22.07,56.82 | 68.62,36.28 C29.1 68.49,36.39 IC2.8 | IC1.8 22.23,37.04 v22.2,37.01 | IC5.8 22.14,31.82 C17.2 22.18,33.05 v22.2,33.07 | R37.2 10.95,79.48 v10.64,79.17
  Top 0.305: C29.1 74.93,36.4 v75.79,37.26 | v78.71,58.72 C14.2 77.62,57.21 IC7.8 | U3.VIN 12.52,95.71 v12.55,95.68
  Top 0.406: D1.C 66.27,97.03 | 66.27,97.03 63.91,97.03 61.95,98.98 11.28,98.98 10.77,98.48 10.77,95.75 U3.VIN | 66.27,97.03 68.21,95.09 C2.+ 66.27,87.48 66.27,82.35 | R26.2 65.45,81.52 66.27,82.35 | v76.43,77.27 71.35,77.27 66.27,82.35
  Bottom 0.203: v22.07,56.82 22.33,56.57 22.33,49.71 19.66,47.04 19.66,44.37 22.2,41.83 v22.2,37.01 v22.2,33.07 | v7.85,56.95 7.85,65.71 9.75,67.61 9.75,78.28 v10.64,79.17
  Bottom 0.305: v75.79,37.26 75.79,41.96 78.08,44.25 78.08,58.09 v78.71,58.72 | v12.55,95.68 12.55,81.08 v10.64,79.17
  Bottom 0.406: v78.71,58.72 78.71,75.62 v76.43,77.27
-5V  (via drill 0.33)
  Top 0.203: IC1.7 25.22,39.95 | 25.22,39.95 R1.1 25.22,40.02 25.22,41.3 25.83,41.91 | 25.22,39.95 23.17,39.95 C7.1 | 42.14,65.96 46.33,65.96 47.6,67.24 U$1.20 48.3,67.11 v53.57,67.11 | 42.14,65.96 28.93,65.96 v28.55,65.58 | v28.27,41.91 25.83,41.91 | RES_1_OFF.1 21.5,44.21 22.17,43.54 25.02,43.54 25.63,42.93 25.63,42.11 25.83,41.91 | R23.1 39.92,94.86 v39.73,94.67 | v39.98,81.84 40.99,81.84 | 40.99,81.84 R53.1 | 40.99,81.84 40.99,80.57 v41.12,80.44 | v41.12,67.23 41.12,66.98 42.14,65.96
  Bottom 0.203: v28.55,65.58 28.55,55.4 28.07,54.91 26.85,54.91 26.24,54.3 26.24,50.44 26.64,50.04 28.07,50.04 28.68,49.43 28.68,42.32 v28.27,41.91 | v39.73,94.67 39.73,82.09 v39.98,81.84 | v41.12,80.44 v41.12,67.23 | RES_2_OFF.1 53.24,46.84 53.95,47.55 53.95,66.73 v53.57,67.11
-12V  (via drill 0.33)  (1 unrouted)
  Top 0.203: C22.1 1.19,62.72 IC8.4 1.81,60.32 v1.88,60.25 | C15.2 63.41,30.49 | 63.41,30.49 IC2.4 | 63.41,30.49 65.59,30.49 v65.76,30.66 | v64.36,58.47 68.3,58.47 68.81,58.98 68.81,59.49 | 68.81,59.49 68.81,61.26 69.06,61.52 71.98,61.52 v72.11,61.65 73.04,61.65 IC7.4 | 63.42,28.81 63.47,28.75 v63.47,27.61 | v63.22,24.94 v46.84,24.94 | v46.84,17.58 v34.65,17.58 | v34.65,24.94 29.69,24.94 v29.57,25.07 | v29.44,31.67 27.93,31.67 IC1.4 | v2.01,43.48 12.42,43.48 12.93,42.98 12.93,37.52 13.44,37.01 15.5,37.01 IC5.4 15.51,35.31 15.72,35.1 27.53,35.1 v27.79,34.85 | C41.1 70.03,58.26 68.81,59.49
  Top 0.406: C12.- 72.28,93.74 73.13,92.89 73.13,84.12 v73,84 77.03,79.97 D2.A
  Bottom 0.203: v65.76,30.66 65.76,35.23 64.24,36.75 64.24,58.34 v64.36,58.47 | v63.47,27.61 63.47,25.2 v63.22,24.94 | v46.84,24.94 v46.84,17.58 | v34.65,17.58 v34.65,24.94 | v29.57,25.07 29.57,31.55 v29.44,31.67 27.79,33.32 v27.79,34.85 | v1.88,60.25 1.88,43.61 v2.01,43.48 | v73,84 73.57,83.43 73.89,83.11 75.29,81.71 75.29,64.82 v72.11,61.65
ADC_DCA_1  (via drill 0.33)
  Top 0.203: IC6.33 33.02,34.18 v32.49,34.72 | v34.39,91.74 34.52,92.87 R40.1
  Bottom 0.203: v32.49,34.72 32.49,43.74 34.39,45.64 v34.39,91.74
ADC_DCA_2  (via drill 0.33)
  Top 0.203: IC6.32 33.49,34.98 v33.25,35.23 | v35.03,74.73 37.69,74.73 42.27,79.3 42.34,79.22 R41.1
  Bottom 0.203: v33.25,35.23 33.25,43.74 34.9,45.39 v35.03,74.73
ADC_FILTER_1  (via drill 0.33)
  Top 0.203: v60.43,28.24 59.79,27.61 43.41,27.61 43.03,27.99 43.03,29.51 42.65,29.9 40.23,29.9 39.22,30.91 39.22,32.37 IC6.37 | D13.3 65.68,54.74 65.13,55.3 65.13,56.38 R28.1 62.84,54.48 v62.84,54.28
  Bottom 0.203: v60.43,28.24 60.43,44.5 62.84,46.91 v62.84,54.28
ADC_FILTER_2  (via drill 0.33)
  Top 0.203: C21.2 76,54.05 R15.1 75.77,54.27 IC7.7 | v62.08,28.24 61.06,27.23 43.15,27.23 42.52,27.86 42.52,29.13 42.27,29.39 40.11,29.39 38.33,31.17 38.33,32.69 38.58,32.94 38.58,32.56 IC6.36 38.46,32.34 | v62.08,45.14 77.57,45.14 78.71,46.28 78.71,49.83 78.08,50.47 76.73,50.47 D3.3 76.43,51.61 C21.2 | C21.2 76.06,52.04
  Bottom 0.203: v62.08,28.24 v62.08,45.14
ADC_MISO
  Top 0.203: IC6.2 47.59,34.98 48.79,33.78 51.12,33.78 PGM.1
ADC_RES_1  (via drill 0.33)
  Top 0.203: IC6.35 37.61,34.38 v37.69,34.47 | R44.1 35.71,79.6 v35.41,79.55
  Bottom 0.203: v37.69,34.47 37.69,35.36 36.93,36.12 36.93,37.26 37.44,37.77 37.44,42.09 35.66,43.87 35.66,78.92 35.41,79.17 v35.41,79.55
ADC_RES_2  (via drill 0.33)
  Top 0.203: IC6.34 36.81,35.23 v37.95,36.37 | R43.1 46.21,93.14 47.22,93.14 47.73,93.65 47.6,93.78 47.6,96.82 45.95,98.48 36.42,98.48 v36.17,98.22
  Bottom 0.203: v37.95,36.37 37.95,42.34 36.17,44.12 v36.17,98.22
ADC_SCK
  Top 0.203: PGM.3 53.68,34.38 53.26,34.8 48.79,34.8 47.78,35.81 46.64,35.81 IC6.3
AUDIO_IN_1
  Top 0.203: U$1.27 64.8,49.46 R5.2 64.81,49.47 R4.1
AUDIO_IN_2
  Top 0.203: U$1.21 57.6,64.7 R42.1 57.66,62.65 R45.2
AUDIO_OUT_1  (via drill 0.33)
  Top 0.203: 30.51,19.56 v31.11,20.17 30.06,19.11 C26.+ | v29.49,50.04 30.91,50.04 31.72,50.85 44.47,50.85 U$1.25
  Bottom 0.203: v31.11,20.17 31.11,39.67 29.49,41.3 v29.49,50.04
AUDIO_OUT_2  (via drill 0.33)
  Top 0.203: U$1.23 48.16,59.57 46.96,58.37 16.89,58.37 v16.48,57.96 | v16.28,51.46 14.09,51.46 C5.+
  Bottom 0.203: v16.48,57.96 16.48,51.66 v16.28,51.46
D0  (via drill 0.33)
  Top 0.203: IC6.40 41.61,34.11 41.38,34.34 40.61,34.34 40.36,34.59 v39.45,34.59 | v39.85,48.21 34.21,48.21 U$1.1
  Bottom 0.203: v39.45,34.59 39.45,35.41 39.85,35.81 v39.85,48.21
D1  (via drill 0.33)
  Top 0.203: IC6.41 42.41,34.28 41.88,34.8 40.87,34.8 v40.46,35.2 | v40.06,49.43 32.95,49.43 U$1.2
  Bottom 0.203: v40.46,35.2 40.46,49.02 v40.06,49.43
D2  (via drill 0.33)
  Top 0.203: IC6.42 43.21,34.49 42.29,35.41 41.48,35.41 v41.27,35.61 | v41.07,52.07 32.99,52.07 U$1.3
  Bottom 0.203: v41.27,35.61 41.27,51.87 v41.07,52.07
D3  (via drill 0.33)
  Top 0.203: IC6.43 44.01,34.5 v42.29,36.22 | v41.88,54.71 33.1,54.71 U$1.4
  Bottom 0.203: v42.29,36.22 42.29,54.3 v41.88,54.71
D4  (via drill 0.33)
  Top 0.203: U$1.5 45.61,57.08 v46.15,56.54 | v46.15,43.33 46.15,42.64 IC6.11
  Bottom 0.203: v46.15,56.54 v46.15,43.33
D5  (via drill 0.33)
  Top 0.203: U$1.6 44.7,59.62 v44.93,59.38 | v44.93,47.8 44.93,44.11 IC6.12
  Bottom 0.203: v44.93,59.38 v44.93,47.8
D6  (via drill 0.33)
  Top 0.203: U$1.7 43.78,62.16 v44.12,61.82 | v44.12,46.79 44.12,44.1 IC6.13
  Bottom 0.203: v44.12,61.82 v44.12,46.79
D7  (via drill 0.33)
  Top 0.203: U$1.8 42.87,64.7 v43.1,64.46 | v43.1,45.77 43.1,44.09 IC6.14
  Bottom 0.203: v43.1,64.46 v43.1,45.77
GND  (via drill 0.33)
  other vias: 45.31,29.51 45.44,28.5 47.73,29.64
  pour Bottom: -1.04,101.4 81.66,103.62 81.25,0.95 -1.04,-1.47
  pour Top: -1.04,101.4 81,100.56 81,-1.7 -1.04,-1.47
I7
  Top 0.203: 4.57,54.64 R35.1 4.55,53.79 C9.2 | 4.57,54.64 4.29,54.91 4.29,56.86 IC8.7 | 4.57,54.64 6.55,54.64 7.72,55.8 61.95,55.8 63.73,57.58 66.27,57.58 66.52,57.33 66.52,56.64 R28.2
LED_I/MOSI  (via drill 0.33)
  Top 0.203: PGM.4 53.67,29.51 52.86,28.7 46.76,28.7 v46.35,29.11 | v46.56,33.17 46.56,34.14 IC6.1
  Bottom 0.203: v46.35,29.11 46.35,32.97 v46.56,33.17
N$1
  Top 0.406: D2.C 77.8,87.48 SV5.2 SV5.1
N$2
  Top 0.203: IC1.6 26.49,39.77 R1.2 26.79,40.07 R3.1
N$3
  Top 0.813: SV5.10 SV5.9 72.39,97.9 D1.A
N$4  (via drill 0.33)
  Top 0.203: R4.2 71.81,47.47 v71.86,47.42 | IC2.7 68.84,32.82 68.84,31.98 | 68.84,31.98 IC2.6 | 68.84,31.98 68.84,31.83 68.81,31.8 70.08,31.8 v70.59,31.29
  Bottom 0.203: v71.86,47.42 71.86,37.01 69.95,35.1 69.95,31.55 70.21,31.29 v70.59,31.29
N$5
  Bottom 0.203: RES_1_CV.P$1 25.94,0.97 26.44,1.47 RES_1_ATTN.3
N$6
  Top 0.203: IC5.2 18.05,40.08 R6.2 C6.1 16.03,41.87 R2.1
N$7  (via drill 0.33)
  Top 0.203: IC5.1 19.32,37.9 | 19.32,37.9 19.32,39.82 R6.1 C6.2 | R8.2 44.84,13.1 v44.81,13.13 | v44.81,26.09 21.82,26.09 v20.93,26.97 | v20.55,36.63 20.55,36.67 19.32,37.9
  Bottom 0.203: v44.81,13.13 v44.81,26.09 | v20.93,26.97 20.93,36.25 v20.55,36.63
N$8
  Top 0.203: R2.2 14.47,43.77 R51.1 14.37,47.98 C5.-
N$9
  Top 0.203: A_OUT_1.P$1 36.22,0.89 37.01,1.68 37.01,11.76 R49.1 37.11,14.08 R16.2
N$10  (via drill 0.33)
  Top 0.203: R30.1 23.93,59.92 v23.8,59.79
  Bottom 0.203: v23.8,59.79 23.8,45.79 RES_1_OFF.2
N$11  (via drill 0.33)
  Top 0.203: R39.1 42.9,83.77 IC3.6 42.9,87.81 43.66,88.57 v48.11,88.57 | R39.1 41.17,83.54 R53.2 | R39.1 42.68,81.39 C24.1 | R31.2 72.63,30.01 73.13,29.51 78.33,29.51 v78.46,29.64 | v76.05,74.22 54.08,74.22 v53.95,74.35 | v53.95,79.3 51.54,79.3 v48.23,82.6
  Bottom 0.203: v78.46,29.64 78.46,35.23 | 76.05,73.96 v76.05,74.22 | v53.95,74.35 v53.95,79.3 | v48.23,82.6 48.23,88.44 v48.11,88.57
  Bottom 0.305: 76.05,73.96 76.05,43.87 73.89,41.71 73.89,36.63 75.16,35.36 78.33,35.36 78.46,35.23
N$12
  Top 0.203: IC3.1 36.55,84.02 R25.2 36.2,81.81 C11.2 36.04,81.65 36.04,80.82 36.3,80.57 38.84,80.57 39.12,80.29 R44.2
N$13  (via drill 0.33)
  Top 0.203: IC1.2 25.22,30.12 25.56,29.79 R11.2 25.57,29.01 31.34,29.01 32.99,30.66 v34.9,30.66 | R9.1 44.88,15.35 44.53,15.7 42.9,15.7 41.68,14.48 39.45,14.48 38.23,15.7 35.79,15.7 | 35.79,15.7 35.38,15.29 35.38,14.29 R16.1 | 35.79,15.7 v35.79,16.31
  Bottom 0.203: v35.79,16.31 35.79,29.77 v34.9,30.66
N$14
  Top 0.203: IC1.1 24.03,31.75 R11.1 23.98,28.96 23.98,28.12 24.77,27.32 R13.2
N$15  (via drill 0.33)
  Top 0.203: v24.49,61.26 24.49,61.9 24.74,62.15 25.88,62.15 R29.1
  Bottom 0.203: RES_1_ATTN.2 23.94,38.75 28.17,42.98 28.17,49.2 27.91,49.45 26.26,49.45 25.25,50.47 25.25,60.5 v24.49,61.26
N$16
  Top 0.203: A_OUT_2.P$1 43.78,1 43.1,1.68 43.1,11.67 R8.1 43.31,14.31 R9.2
N$17  (via drill 0.33)
  Top 0.203: C4.- 32.86,22.9 v32.87,22.91 | IC2.5 68.94,30.18 68.94,27.61 68.17,26.85 42.9,26.85 42.01,27.74 42.01,28.88 41.88,29.01 39.85,29.01 38.96,29.9 v34.01,29.9
  Bottom 0.203: v32.87,22.91 32.87,28.75 v34.01,29.9
N$18
  Top 0.203: A_IN_1.P$1 7.71,1.03 8.56,1.88 8.56,11.82 | 8.56,11.82 R7.2 | 8.56,11.82 8.56,13.87 8.76,14.07 32.54,14.07 32.94,14.48 32.94,17.32 C4.+
N$19  (via drill 0.33)
  Top 0.203: C25.- 63.33,19.33 v65,21.01 | v65,31.8 63.45,31.8 IC2.3
  Bottom 0.203: v65,21.01 v65,31.8
N$20
  Bottom 0.203: DCA_1_CV.P$1 6.32,31.19 DCA_1_ATTN.3
N$21  (via drill 0.33)
  Top 0.203: C16.1 42.55,94.76 R19.1 42.51,93.66 43.03,93.14 43.03,92.49 IC3.9 42.9,91.23 43.28,90.86 49.38,90.86 52.3,93.78 58.78,93.78 v61.95,90.6 61.7,90.86 | R17.2 61.26,16.74 v57.89,20.12 | v59.41,58.6 59.41,59.52 R18.2 59.03,59.9 v59.03,60.88
  Bottom 0.203: v57.89,20.12 57.89,42.72 61.06,45.9 61.06,47.42 57.76,50.72 57.76,56.95 v59.41,58.6 | v59.03,60.88 59.03,72.31 64.11,77.39 64.11,86.28 61.95,88.44 v61.95,90.6
N$22  (via drill 0.33)
  Top 0.203: R18.1 56.64,59.72 v55.91,58.98
  Bottom 0.203: v55.91,58.98 55.91,45.66 RES_2_OFF.2
N$23
  Bottom 0.203: RES_2_CV.P$1 57.46,1.15 58.65,2.34 58.65,15.33 RES_2_ATTN.3
N$24  (via drill 0.33)
  Top 0.203: R23.2 40.2,97.13 C23.1 37.9,94.93 R27.1 37.81,92.38 IC3.13 37.82,90.73 37.57,90.47 v28.42,90.47 | v19.41,75.11 v4.55,75.11 | v5.31,36.63 9.12,36.63 10.39,35.36 10.39,31.55 9.75,30.91 8.31,30.91 R20.2
  Bottom 0.203: v4.55,75.11 4.55,37.39 v5.31,36.63 | v19.41,75.11 23.09,75.11 24.87,76.89 24.87,86.92 v28.42,90.47
N$25
  Top 0.203: R20.1 6.74,32.78 DCA_1_ATTN.2
N$26
  Top 0.203: DCA_2_ATTN.2 74.14,30.87 R31.1
N$27
  Top 0.203: IC3.8 44.17,94.57 R19.2 | R19.2 44.03,96.79 C16.2 | R19.2 46.04,94.72 R43.2
N$28  (via drill 0.33)
  Top 0.203: IC2.2 IC2.1 63.42,35.3 v63.47,35.36 | v61.19,62.66 61.19,64.06 60.55,64.69 59.25,64.69 R42.2
  Bottom 0.203: v63.47,35.36 63.47,60.38 v61.19,62.66
N$29
  Top 0.203: A_IN_2.P$1 72.7,0.99 71.35,2.34 71.35,8.69 72.62,9.96 73.13,9.96 73.51,10.34 73.51,11.95 R46.2 73.3,14.23 72.62,14.91 67.28,14.91 66.4,15.8 66.4,18.72 C25.+
N$30
  Top 0.203: R47.1 16.36,26.08 C27.1 16.41,28.79 R48.2 16.56,29.99 16.89,30.33 16.89,31.72 IC5.6
N$31  (via drill 0.33)
  Top 0.203: R49.2 35.41,11.86 34.57,11.02 16.48,11.02 v16.28,11.23 | IC5.7 18.08,31.8 R48.1 18.11,28.91 18.11,26.67 17.94,26.5 C27.2 16.28,24.47 v16.28,24.43
  Bottom 0.203: v16.28,11.23 v16.28,24.43
N$32
  Top 0.203: C26.- 12.67,19.11 12.42,19.35 12.42,26.01 R47.2 12.49,28.68 R50.1
N$33
  Bottom 0.203: DCA_2_CV.P$1 75.48,27.81 76.56,28.88 76.56,33.12 DCA_2_ATTN.3
N$34
  Top 0.203: R13.1 39.16,28.85 MIX_OUT.P$1
N$35
  Top 0.203: R10.2 60.31,79.42 59.92,79.81 59.92,84.13 FILTER_RIGHT.2
N$36  (via drill 0.33)
  Top 0.203: R10.1 65.77,79.42 v67.54,79.43 | IC7.2 75.77,64.43 R14.2 75.07,64.61 72.31,64.61 FILTER_ATT_RIGHT.3
  Bottom 0.203: v67.54,79.43 67.54,66.99 FILTER_ATT_RIGHT.3
N$37  (via drill 0.33)
  Top 0.203: U$1.10 39.01,69.78 v39.24,69.54 | v39.24,46.79 39.24,44.02 IC6.19
  Bottom 0.203: v39.24,69.54 v39.24,46.79
N$38  (via drill 0.33)
  Top 0.203: U$1.9 37.89,67.24 v38.43,66.7 | v38.43,45.57 38.43,44.01 IC6.20
  Bottom 0.203: v38.43,66.7 v38.43,45.57
N$39  (via drill 0.33)
  Top 0.203: U$1.19 40.43,69.78 39.24,70.97 37.82,70.97 v37.62,70.76 | v37.62,47.19 IC6.21
  Bottom 0.203: v37.62,70.76 v37.62,47.19
N$40  (via drill 0.33)
  Top 0.203: C11.1 37.72,81.72 R25.1 37.82,83.77 IC3.2 37.82,87.68 37.31,88.19 32.49,88.19 v32.11,87.81 | R30.2 R29.2 | R29.2 | R29.2 27.48,63.1 v27.03,63.55 | v27.15,76.38 29.82,76.38 v30.45,77.01
  Bottom 0.203: v27.03,63.55 27.03,76.25 v27.15,76.38 | v30.45,77.01 30.45,86.16 v32.11,87.81
N$41  (via drill 0.33)
  Top 0.203: R12.1 67.61,59.56 v67.54,59.49
  Bottom 0.203: FILTER_RIGHT_CV.P$1 67.92,2.93 67.92,13 66.65,14.27 66.65,34.85 67.41,35.61 67.41,59.36 v67.54,59.49
N$42  (via drill 0.33)
  Top 0.203: U$1.13 35.15,77.4 v36.8,75.74 | IC6.22 36.81,45.39 v36.93,45.52
  Bottom 0.203: v36.8,75.74 36.8,45.77 v36.93,45.52
N$43
  Top 0.203: R12.2 66.09,61.34 66.4,61.65 68.17,61.65 68.55,62.03 68.55,63.35 FILTER_ATT_RIGHT.2
N$44
  Top 0.203: R22.2 IC7.1 77.04,64.68 R14.1
N$45  (via drill 0.33)
  Top 0.203: C21.1 74.52,52.1 74.52,54.41 74.37,54.25 R15.2 74.5,54.28 IC7.6 74.52,56.66 74.52,58.22 75.79,59.49 | R22.1 76.61,60.3 75.79,59.49 | v71.35,59.49 75.79,59.49
  Bottom 0.203: v71.35,59.49 70.04,59.49 FILTER_ATT_RIGHT.1
N$46
  Top 0.203: R26.1 62.15,83.86 FILTER_RIGHT.3
N$47  (via drill 0.33)
  Top 0.203: U$1.12 30.84,74.86 v30.71,74.73 | v30.71,41.71 32.61,41.71 33.12,42.21 34.98,42.21 IC6.23
  Bottom 0.203: v30.71,74.73 v30.71,41.71
N$48  (via drill 0.33)
  Top 0.203: R32.2 v2.67,67.31 | v3.07,78.08 23.39,78.08 v23.8,78.49
  Bottom 0.203: v2.67,67.31 2.67,77.67 v3.07,78.08 | FILTER_LEFT.2 20.15,82.14 v23.8,78.49
N$49
  Top 0.203: IC8.2 4.35,64.87 | 4.35,64.87 4.35,66.11 R32.1 | 4.35,64.87 4.75,65.28 6.07,65.28 | 6.07,65.28 13.36,65.28 14.2,64.44 14.2,63.45 FILTER_ATT_LEFT.3 | R34.2 8.39,60.34 6.71,62.03 6.71,64.64 6.07,65.28
N$50
  Top 0.203: FILTER_LEFT_CV.P$1 11.13,0.93 10.19,1.88 10.19,12.01 R33.1
N$51
  Top 0.203: IC8.1 7.34,60.4 7.34,59.61 7.72,59.23 9.88,59.23 10.13,59.49 10.13,60.3 R34.1 10.21,60.38 R36.2
N$52
  Top 0.203: 3.07,57.56 3.05,57.53 R35.2 3.02,53.79 C9.1 | 3.07,57.56 IC8.6 | 3.07,57.56 3.07,58.37 3.48,58.78 13.36,58.78 14.2,59.61 14.2,60.36 R36.1 14.18,61.15 13.69,61.65 9.63,61.65 9.25,62.03 FILTER_ATT_LEFT.1
N$53
  Top 0.203: R37.1 22.58,84.01 FILTER_LEFT.3
N$54  (via drill 0.33)
  Top 0.203: U$1.11 31.45,72.32 v31.32,72.19 | v31.52,40.89 32.94,40.89 33.35,41.3 33.35,41.43 33.38,41.45 34.94,41.45 IC6.24
  Bottom 0.203: v31.32,72.19 31.32,41.1 v31.52,40.89
N$55  (via drill 0.33)
  Top 0.203: R33.2 v11.81,13.26
  Bottom 0.203: v11.81,13.26 11.81,35.61 14.25,38.05 14.25,60.9 FILTER_ATT_LEFT.2
N$56
  Top 0.203: U$1.18 49.23,72.32 U1.4
N$58
  Top 0.203: RES_2_ATTN.2 55.8,14.84 56.36,14.27 60.64,14.27 R17.1
N$60
  Top 0.203: R38.1 50.46,77.97 U1.3 50.46,75.17 51.16,74.47 52.17,74.47 52.3,74.35 52.3,73.61 U1.6 56.01,73.55 QF1.1
N$62
  Top 0.203: QF1.3 52.68,77.9 R38.2 52.3,76.21 U1.1
REL1_ADC
  Top 0.203: R40.2 34.34,95.27 C23.2 36.2,94.93 R27.2 36.28,92.63 IC3.14
REL2_ADC
  Top 0.203: IC3.7 44.2,86.19 R39.2 44.25,83.5 C24.2 44.16,81.17 R41.2
RESET
  Top 0.203: PGM.5 56.22,34.69 | 56.22,34.69 55.7,35.2 49.2,35.2 48.59,35.81 48.59,36.22 48.18,36.63 46.65,36.63 IC6.4 | 56.22,34.69 58.96,34.69 R21.1
TX
  Top 0.203: IC6.10 48.17,41.38 48.17,43.42 49,44.25 65.13,44.25 65.89,43.48 65.89,41.68 TX.2
XTAL1
  Top 0.203: IC6.8 50.1,39.78 Y2.2 | 51.89,40.73 Y2.2 | C19.2 50.37,40.05 Y2.2
XTAL2
  Top 0.203: Y2.1 60.69,40.71 C20.2 60.69,36.12 60.17,35.61 49.4,35.61 49,36.02 49,38.66 48.59,39.06 46.69,39.06 IC6.7

### Text on the board
bNames: REV003